# EAGLE design source_selector_v2 (EAGLE 7.5.0)
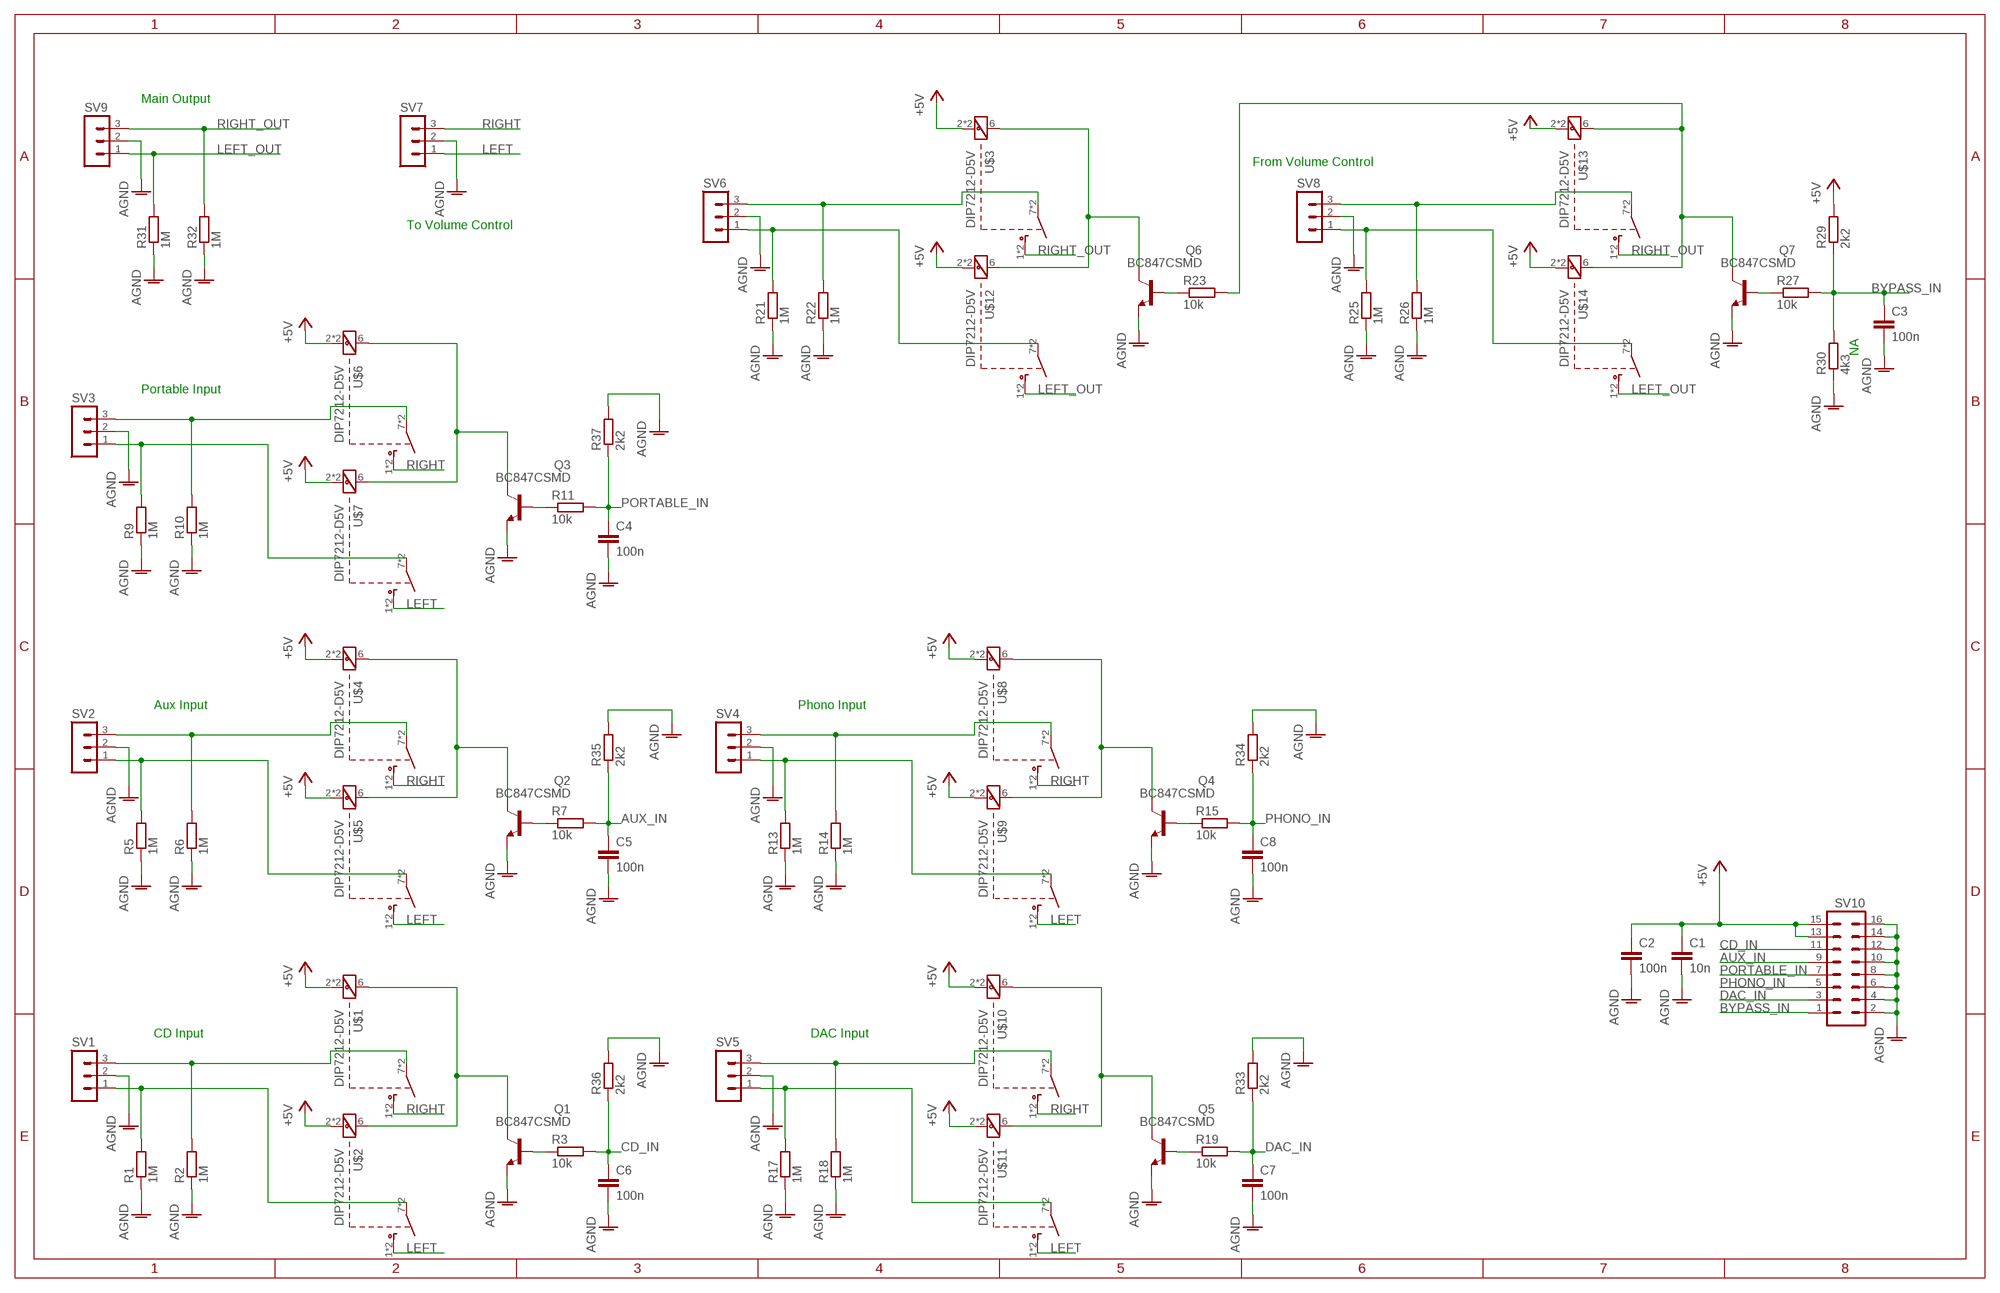
[diagram p0: schematic, sheet 1]

## Parts
C1  10n  C-EUC0603  [C0603]
C2  100n  C-EUC0603  [C0603]
C3  100n  C-EUC0603  [C0603]
C4  100n  C-EUC0603  [C0603]
C5  100n  C-EUC0603  [C0603]
C6  100n  C-EUC0603  [C0603]
C7  100n  C-EUC0603  [C0603]
C8  100n  C-EUC0603  [C0603]
Q1  BC847CSMD  [SOT23]
Q2  BC847CSMD  [SOT23]
Q3  BC847CSMD  [SOT23]
Q4  BC847CSMD  [SOT23]
Q5  BC847CSMD  [SOT23]
Q6  BC847CSMD  [SOT23]
Q7  BC847CSMD  [SOT23]
R1  1M  R-EU_R0603  [R0603]
R2  1M  R-EU_R0603  [R0603]
R3  10k  R-EU_R0603  [R0603]
R5  1M  R-EU_R0603  [R0603]
R6  1M  R-EU_R0603  [R0603]
R7  10k  R-EU_R0603  [R0603]
R9  1M  R-EU_R0603  [R0603]
R10  1M  R-EU_R0603  [R0603]
R11  10k  R-EU_R0603  [R0603]
R13  1M  R-EU_R0603  [R0603]
R14  1M  R-EU_R0603  [R0603]
R15  10k  R-EU_R0603  [R0603]
R17  1M  R-EU_R0603  [R0603]
R18  1M  R-EU_R0603  [R0603]
R19  10k  R-EU_R0603  [R0603]
R21  1M  R-EU_R0603  [R0603]
R22  1M  R-EU_R0603  [R0603]
R23  10k  R-EU_R0603  [R0603]
R25  1M  R-EU_R0603  [R0603]
R26  1M  R-EU_R0603  [R0603]
R27  10k  R-EU_R0603  [R0603]
R29  2k2  R-EU_R0603  [R0603]
R30  4k3  R-EU_R0603  [R0603]
R31  1M  R-EU_R0603  [R0603]
R32  1M  R-EU_R0603  [R0603]
R33  2k2  R-EU_R0603  [R0603]
R34  2k2  R-EU_R0603  [R0603]
R35  2k2  R-EU_R0603  [R0603]
R36  2k2  R-EU_R0603  [R0603]
R37  2k2  R-EU_R0603  [R0603]
SV1  MA03-1  [MA03-1]
SV2  MA03-1  [MA03-1]
SV3  MA03-1  [MA03-1]
SV4  MA03-1  [MA03-1]
SV5  MA03-1  [MA03-1]
SV6  MA03-1  [MA03-1]
SV7  MA03-1  [MA03-1]
SV8  MA03-1  [MA03-1]
SV9  MA03-1  [MA03-1]
SV10  MA08-2  [MA08-2]
U$1  DIP7212-D5V  [DP-07]
U$2  DIP7212-D5V  [DP-07]
U$3  DIP7212-D5V  [DP-07]
U$4  DIP7212-D5V  [DP-07]
U$5  DIP7212-D5V  [DP-07]
U$6  DIP7212-D5V  [DP-07]
U$7  DIP7212-D5V  [DP-07]
U$8  DIP7212-D5V  [DP-07]
U$9  DIP7212-D5V  [DP-07]
U$10  DIP7212-D5V  [DP-07]
U$11  DIP7212-D5V  [DP-07]
U$12  DIP7212-D5V  [DP-07]
U$13  DIP7212-D5V  [DP-07]
U$14  DIP7212-D5V  [DP-07]

## Nets
+5V: C1.1 C2.1 R29.2 SV10.13 SV10.15 U$1.2 U$1.13 U$2.2 U$2.13 U$3.2 U$3.13 U$4.2 U$4.13 U$5.2 U$5.13 U$6.2 U$6.13 U$7.2 U$7.13 U$8.2 U$8.13 U$9.2 U$9.13 U$10.2 U$10.13 U$11.2 U$11.13 U$12.2 U$12.13 U$13.2 U$13.13 U$14.2 U$14.13
AGND: C1.2 C2.2 C3.2 C4.2 C5.2 C6.2 C7.2 C8.2 Q1.2(E) Q2.2(E) Q3.2(E) Q4.2(E) Q5.2(E) Q6.2(E) Q7.2(E) R1.1 R2.1 R5.1 R6.1 R9.1 R10.1 R13.1 R14.1 R17.1 R18.1 R21.1 R22.1 R25.1 R26.1 R30.1 R31.1 R32.1 R33.2 R34.2 R35.2 R36.2 R37.2 SV1.2 SV2.2 SV3.2 SV4.2 SV5.2 SV6.2 SV7.2 SV8.2 SV9.2 SV10.2 SV10.4 SV10.6 SV10.8 SV10.10 SV10.12 SV10.14 SV10.16
AUX_IN: C5.1 R7.2 R35.1 SV10.9
BYPASS_IN: C3.1 R27.2 R29.1 R30.2 SV10.1
CD_IN: C6.1 R3.2 R36.1 SV10.11
DAC_IN: C7.1 R19.2 R33.1 SV10.3
LEFT: SV7.1 U$2.1 U$2.14 U$5.1 U$5.14 U$7.1 U$7.14 U$9.1 U$9.14 U$11.1 U$11.14
LEFT_OUT: R31.2 SV9.1 U$12.1 U$12.14 U$14.1 U$14.14
N$1: R2.2 SV1.3 U$1.7 U$1.8
N$2: R1.2 SV1.1 U$2.7 U$2.8
N$3: Q1.1(B) R3.1
N$4: Q1.3(C) U$1.6 U$2.6
N$5: R6.2 SV2.3 U$4.7 U$4.8
N$6: R5.2 SV2.1 U$5.7 U$5.8
N$7: Q2.1(B) R7.1
N$8: Q2.3(C) U$4.6 U$5.6
N$9: R10.2 SV3.3 U$6.7 U$6.8
N$10: R9.2 SV3.1 U$7.7 U$7.8
N$11: Q3.1(B) R11.1
N$12: Q3.3(C) U$6.6 U$7.6
N$13: R14.2 SV4.3 U$8.7 U$8.8
N$14: R13.2 SV4.1 U$9.7 U$9.8
N$15: Q4.1(B) R15.1
N$16: Q4.3(C) U$8.6 U$9.6
N$17: R18.2 SV5.3 U$10.7 U$10.8
N$18: R17.2 SV5.1 U$11.7 U$11.8
N$19: Q5.1(B) R19.1
N$20: Q5.3(C) U$10.6 U$11.6
N$21: R22.2 SV6.3 U$3.7 U$3.8
N$22: R21.2 SV6.1 U$12.7 U$12.8
N$23: Q6.1(B) R23.1
N$24: Q6.3(C) U$3.6 U$12.6
N$25: R26.2 SV8.3 U$13.7 U$13.8
N$26: R25.2 SV8.1 U$14.7 U$14.8
N$27: Q7.1(B) R27.1
N$29: Q7.3(C) R23.2 U$13.6 U$14.6
PHONO_IN: C8.1 R15.2 R34.1 SV10.5
PORTABLE_IN: C4.1 R11.2 R37.1 SV10.7
RIGHT: SV7.3 U$1.1 U$1.14 U$4.1 U$4.14 U$6.1 U$6.14 U$8.1 U$8.14 U$10.1 U$10.14
RIGHT_OUT: R32.2 SV9.3 U$3.1 U$3.14 U$13.1 U$13.14

## Notes on the sheet
- Main Output
- From Volume Control
- To Volume Control
- NA
- Portable Input
- Aux Input | Phono Input
- CD Input | DAC Input

## Library data of the parts
C1-C8 = rcl:C-EU: CAPACITOR, European symbol
Q1-Q7 = transistor-npn:BC847*: NPN Transistor
R1-R3 R5-R7 R9-R11 R13-R15 R17-R19 R21-R23 R25-R27 R29-R37 = rcl:R-EU_: RESISTOR, European symbol
SV1-SV9 = con-lstb:MA03-1: PIN HEADER; OC_FARNELL: unknown; OC_NEWARK: unknown
SV10 = con-lstb:MA08-2: PIN HEADER; OC_FARNELL: unknown; OC_NEWARK: unknown
U$1-U$14 = meder:DIP7212-D5V: Meder DIP 7212-D 5V Reedrelais, 5V, 1 Schließer mit Diode, 1A http://cdn-reichelt.de/documents/datenblatt/C300/DATASHEET_DIP_NEW.pdf

## Board
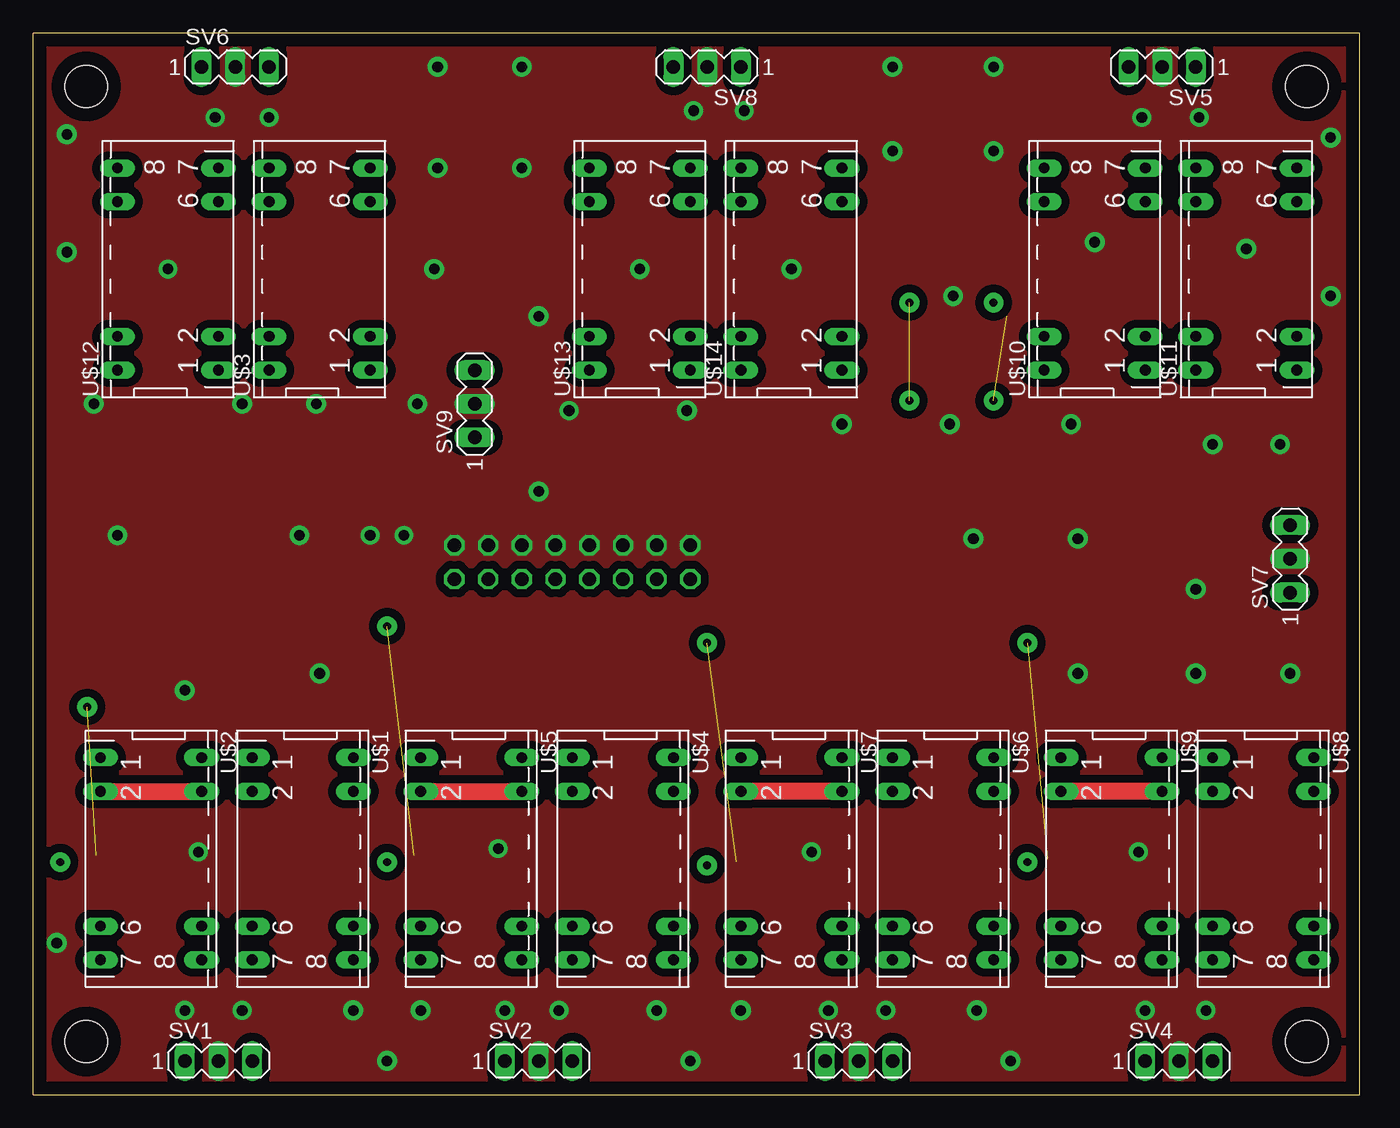
[diagram p1: board, top side]
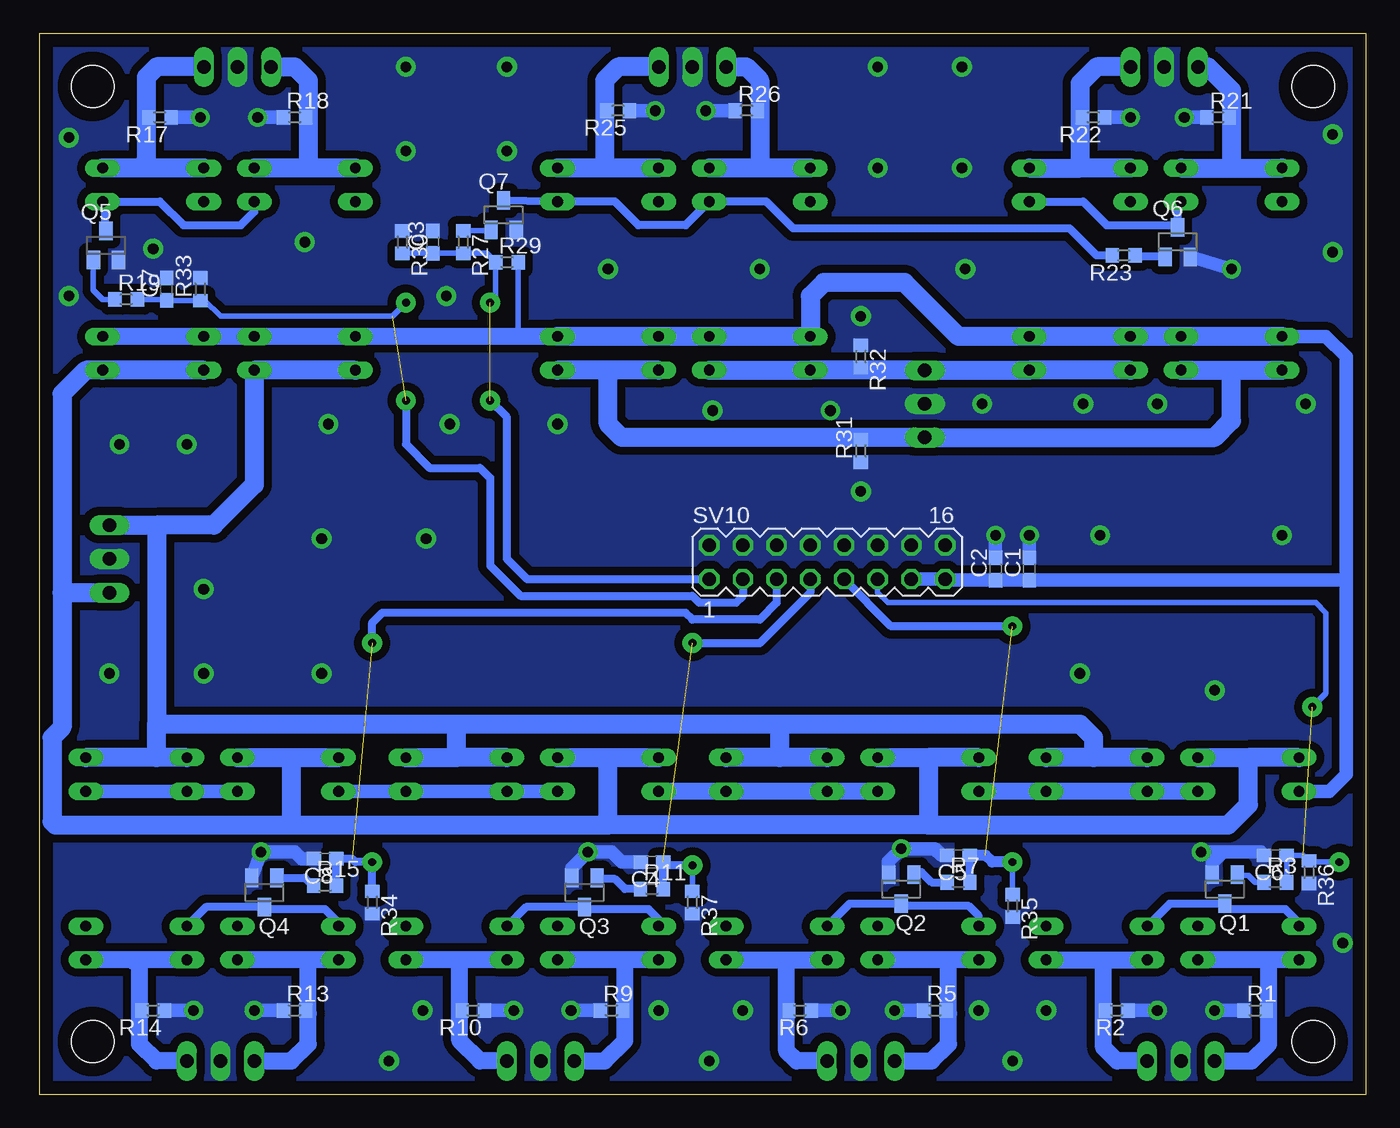
[diagram p2: board, bottom side, seen from below]

Size 100 x 80.01 mm. Coordinates in mm from the lower left corner, seen from the top.
Outline: 0,80 100,80 100,0 0,0 0,80.01
Copper layers (1*16): Top 0.035mm / dielectric 1.5mm / Bottom 0.035mm
Design rules "default *": minimum track width 10mil, minimum drill 0.6mm, track to track 8mil, track to pad 8mil, pad to pad 8mil, via to via 8mil, smd to smd 8mil, copper to edge 40mil, drill to drill 8mil, minimum pad ring 10mil, minimum via ring 8mil, stop-mask expansion 4mil, vias tented up to drill 0mil, thermal gap 10mil
Holes 3.2 mm at 4,4 96,4 96,76 4,76

### Footprints (pad centres in the part's own frame; a part is rotated, then mirrored left to right if it is on the bottom)
C0603 = smd 1.1 x 1: 1 -0.85,0; 2 0.85,0
SOT23 = smd 1 x 1.4: 1 -0.95,-1.1; 2 0.95,-1.1; 3 0,1.1
R0603 = smd 1 x 1.1: 1 -0.85,0; 2 0.85,0
MA03-1 = drill 1.016 long: 1 -2.54,0; 2 0,0; 3 2.54,0
MA08-2 = drill 1.016 octagon: 1 -8.89,-1.27; 2 -8.89,1.27; 3 -6.35,-1.27; 4 -6.35,1.27; 5 -3.81,-1.27; 6 -3.81,1.27; 7 -1.27,-1.27; 8 -1.27,1.27; 9 1.27,-1.27; 10 1.27,1.27; 11 3.81,-1.27; 12 3.81,1.27; 13 6.35,-1.27; 14 6.35,1.27; 15 8.89,-1.27; 16 8.89,1.27
DP-07 = drill 0.813 long: 1 -7.62,-3.81; 2 -5.08,-3.81; 6 5.08,-3.81; 7 7.62,-3.81; 8 7.62,3.81; 9 5.08,3.81; 13 -5.08,3.81; 14 -7.62,3.81

### Placement (x,y rotation side)
C1  25.4,39.62 90 bottom
C2  27.94,39.62 90 bottom
C3  70.36,64.26 90 bottom
C4  53.85,17.53 180 bottom
C5  30.73,18.03 180 bottom
C6  6.86,18.03 180 bottom
C7  90.42,60.71 90 bottom
C8  78.49,17.78 180 bottom
Q1  10.67,15.49 180 bottom
Q2  35.05,15.49 180 bottom
Q3  58.93,15.24 180 bottom
Q4  83.06,15.24 180 bottom
Q5  95,64.01 0 bottom
Q6  14.22,64.26 0 bottom
Q7  65.02,66.29 0 bottom
R1  8.38,6.35 0 bottom
R2  18.8,6.35 180 bottom
R3  6.86,16 0 bottom
R5  32.51,6.35 0 bottom
R6  42.67,6.35 180 bottom
R7  30.73,16 0 bottom
R9  56.9,6.35 0 bottom
R10  67.31,6.35 180 bottom
R11  53.85,15.49 0 bottom
R13  80.77,6.35 0 bottom
R14  91.44,6.35 180 bottom
R15  78.49,15.75 0 bottom
R17  90.93,73.66 180 bottom
R18  80.77,73.66 0 bottom
R19  93.47,59.94 0 bottom
R21  11.18,73.66 0 bottom
R22  20.57,73.66 180 bottom
R23  18.29,63.25 180 bottom
R25  56.39,74.17 180 bottom
R26  46.74,74.17 0 bottom
R27  68.07,64.26 270 bottom
R29  64.77,62.74 0 bottom
R30  72.64,64.26 270 bottom
R31  38.1,48.51 90 bottom
R32  38.1,55.63 270 bottom
R33  87.88,60.71 90 bottom
R34  74.93,14.48 270 bottom
R35  26.67,14.22 270 bottom
R36  4.32,16.76 270 bottom
R37  50.8,14.48 270 bottom
SV1  13.97,2.54 0 top
SV2  38.1,2.54 0 top
SV3  62.23,2.54 0 top
SV4  86.36,2.54 0 top
SV5  85.09,77.47 180 top
SV6  15.24,77.47 0 top
SV7  94.74,40.39 90 top
SV8  50.8,77.47 180 top
SV9  33.27,52.07 90 top
SV10  40.64,40.13 0 bottom
U$1  20.32,17.78 270 top
U$2  8.89,17.78 270 top
U$3  21.59,62.23 90 top
U$4  44.45,17.78 270 top
U$5  33.02,17.78 270 top
U$6  68.58,17.78 270 top
U$7  57.15,17.78 270 top
U$8  92.71,17.78 270 top
U$9  81.28,17.78 270 top
U$10  80.01,62.23 90 top
U$11  91.44,62.23 90 top
U$12  10.16,62.23 90 top
U$13  45.72,62.23 90 top
U$14  57.15,62.23 90 top

### Tracks (layer width: path | path; a pad name or v marks a point on that pad's centre or on a via)
+5V
  Top 1.27: U$7.13 U$7.2 | U$5.2 U$5.13 | U$2.2 U$2.13 | U$9.13 U$9.2
  Bottom 0.406: 74.93,23.11 75.18,22.86 | R29.2 63.92,57.49 64.26,57.15
  Bottom 1.016: C2.1 C1.1 | C2.1 1.69,38.77 1.52,38.61 | U$12.13 3.05,57.15 1.52,55.63 1.52,38.61 | C2.1 31.66,38.77 SV10.15 SV10.13 | U$10.13 73.91,57.15 | U$7.13 U$6.2 U$6.13 75.18,22.86 U$9.2 | U$9.13 U$8.2 U$8.13 | U$2.2 2.79,22.86 1.52,24.13 1.52,38.61
  Bottom 1.27: U$11.2 U$11.13 U$10.2 U$10.13 64.26,57.15 U$14.2 | U$5.2 U$1.13 U$1.2 U$2.13 | U$5.13 U$4.2 U$4.13 U$7.2
  Bottom 1.422: U$12.13 U$12.2 U$3.13 U$3.2 30.73,57.15 34.8,61.21 40.89,61.21 41.91,60.2 U$13.13 U$13.2 U$14.13 U$14.2
AGND  (via drill 0.8 pad 1.42, 0.8 pad 1.5)
  Bottom 1.016: R21.1 v13.72,73.66 | R22.1 v17.78,73.66 | R26.1 v49.78,74.17 | R25.1 v53.59,74.17 | R18.1 v83.57,73.66 | R17.1 v87.88,73.66 | R1.1 v11.43,6.35 | R2.1 v15.75,6.35 | R5.1 v35.56,6.35 | R6.1 v39.62,6.35 | R9.1 v59.94,6.35 | v64.26,6.35 R10.1 | R13.1 v83.82,6.35 | v88.39,6.35 R14.1 | Q4.2 v83.31,18.29 80.77,18.29 80.26,17.78 C8.2 | Q6.2 v10.16,62.23 | C5.2 32,18.03 32.51,18.54 v35.05,18.54 36,17.59 Q2.2 | Q1.2 11.62,17.46 10.92,18.16 v12.45,18.29 7.96,18.29 C6.2 | Q3.2 59.88,17.08 v58.67,18.29 56.9,18.29 56.13,17.53 C4.2 | C2.2 v27.94,42.16 | C1.2 v25.4,42.16
  other vias: 40.39,51.56 2.54,72.39 2.54,63.5 30.48,77.47 36.83,77.47 36.83,69.85 30.48,69.85 64.77,77.47 72.39,77.47 72.39,71.12 64.77,71.12 69.09,50.55 60.96,50.55 49.28,51.56 28.96,52.07 4.57,52.07 20.07,42.16 6.35,42.16 21.59,31.75 11.43,30.48 70.87,41.91 78.23,50.55 88.9,49.02 93.98,49.02 87.63,38.1 87.63,31.75 78.74,31.75 78.74,41.91 73.66,2.54 71.12,6.35 53.34,6.35 49.53,2.54 46.99,6.35 29.21,6.35 26.67,2.54 24.13,6.35 21.34,52.07 38.1,45.47 38.1,58.67 30.23,62.23 15.75,52.07 45.72,62.23 57.15,62.23 1.78,11.43 80.01,64.26 91.44,63.75 69.34,60.2 94.74,31.75 97.79,60.2 97.79,72.14
  pour Top (isolate 0.61, no thermals): 0.51,79.5 99.57,79.5 99.57,0.51 0.51,0.51
  pour Bottom (isolate 0.61, no thermals): 0,80.01 100.33,80.01 100.33,0 0,0
AUX_IN  (via drill 0.6 pad 1.5)  (1 unrouted)
  Bottom 0.406: R35.1 v26.67,17.53
  Bottom 0.61: R7.2 C5.1 | v26.67,35.31 35.81,35.31 SV10.9
  Bottom 0.813: v26.67,17.53 28.19,17.53 28.7,18.03 C5.1
BYPASS_IN  (via drill 0.6 pad 1.5)  (1 unrouted)
  Bottom 0.406: R30.2 C3.1 R27.2 66.29,63.41 R29.1 65.62,60.11 v66.04,59.69
  Bottom 0.61: SV10.1 63.25,38.86 64.77,40.39 64.77,51.05 v66.04,52.32
CD_IN  (via drill 0.6 pad 1.5)  (1 unrouted)
  Bottom 0.406: R3.2 C6.1 4.74,18.03 R36.1 4.23,17.53 v2.03,17.53 | SV10.11 36.83,37.85 36.07,37.08 3.81,37.08 3.05,36.32 3.05,30.23 v4.06,29.21
DAC_IN  (via drill 0.6 pad 1.5)  (1 unrouted)
  Bottom 0.406: 72.56,59.86 v72.39,59.69 73.41,58.67 86.36,58.67 87.54,59.86 R33.1 C7.1 90.51,59.94 R19.2
  Bottom 0.61: SV10.3 46.99,37.59 47.5,37.08 50.29,37.08 50.8,37.59 63.75,37.59 66.04,39.88 66.04,46.48 66.8,47.24 70.61,47.24 72.39,49.02 v72.39,52.32
LEFT
  Bottom 1.422: 98.3,37.85 SV7.1 | U$9.14 81.03,25.4 | 81.03,25.4 U$9.1 | 81.03,25.4 81.03,20.32 | 81.03,20.32 57.15,20.32 | U$7.14 57.15,25.4 | 57.15,25.4 U$7.1 | 57.15,20.32 57.15,25.4 | U$5.1 33.02,25.4 | U$2.1 8.89,25.4 | U$2.14 8.89,25.4 | 33.02,20.32 57.15,20.32 | U$5.14 33.02,25.4 | 33.02,25.4 33.02,20.32 | U$11.14 U$11.1 96.52,54.61 98.3,52.83 98.3,37.85 | 98.3,37.85 98.3,27.69 99.06,26.92 99.06,20.57 98.81,20.32 81.03,20.32 | 33.02,20.32 10.41,20.32 8.89,21.84 8.89,25.4
LEFT_OUT
  Bottom 0.254: R31.2 35.47,49.36 35.31,49.53
  Bottom 1.422: U$12.1 10.41,54.61 | 10.41,54.61 U$12.14 | U$14.14 57.4,54.61 | 57.4,54.61 U$14.1 | 57.4,54.61 57.15,54.36 57.15,50.55 56.13,49.53 35.31,49.53 SV9.1 11.43,49.53 10.16,50.8 10.16,54.36 10.41,54.61
N$1
  Bottom 0.61: R2.2 19.65,6.26 19.81,6.1
  Bottom 1.27: U$1.8 19.81,10.16 | 19.81,10.16 U$1.7 | SV1.3 18.8,2.54 19.81,3.56 19.81,6.1 19.81,10.16
N$2
  Bottom 0.61: R1.2 7.37,6.35
  Bottom 1.27: U$2.7 7.37,10.16 | 7.37,10.16 U$2.8 | SV1.1 8.64,2.54 7.37,3.81 7.37,6.35 7.37,10.16
N$3
  Bottom 0.406: 9.55,16.76 Q1.1 9.63,16.51 8.89,16.51 8.38,16 R3.1
N$4
  Bottom 0.61: U$2.6 5.08,12.95 6.1,13.97 10.24,13.97 Q1.3 | 10.33,14.06 Q1.3 | Q1.3 14.82,14.39 U$1.6
N$5
  Bottom 0.61: R6.2 43.69,6.35
  Bottom 1.27: U$4.8 43.43,10.16 | 43.43,10.16 U$4.7 | SV2.3 42.93,2.54 43.69,3.3 43.69,6.35 43.69,9.91 43.43,10.16
N$6
  Bottom 0.61: R5.2 31.66,6.26 31.5,6.1
  Bottom 1.27: U$5.7 31.5,10.16 | 31.5,10.16 U$5.8 | SV2.1 32.77,2.54 31.5,3.81 31.5,6.1 31.5,10.16
N$7
  Bottom 0.61: Q2.1 33.93,16.76 33.53,16.76 32.77,16 R7.1
N$8
  Bottom 0.61: U$5.6 29.21,13.46 29.97,14.22 34.88,14.22 Q2.3 | 34.97,14.31 Q2.3 | Q2.3 38.95,14.39 U$4.6
N$9
  Bottom 0.61: R10.2 68.16,6.26 68.33,6.1
  Bottom 1.27: U$6.7 68.07,10.16 | 68.07,10.16 U$6.8 | SV3.3 66.8,2.54 68.33,4.06 68.33,6.1 68.33,9.91 68.07,10.16
N$10
  Bottom 0.61: R9.2 56.05,6.26 55.88,6.1
  Bottom 1.27: U$7.7 55.88,10.16 | 55.88,10.16 U$7.8 | SV3.1 57.4,2.54 55.88,4.06 55.88,6.1 55.88,10.16
N$11
  Bottom 0.61: R11.1 55.88,15.49 56.64,16.26 57.89,16.26 Q3.1
N$12
  Bottom 0.61: U$7.6 53.34,13.21 54.1,13.97 58.76,13.97 Q3.3 | 58.85,14.06 Q3.3 | Q3.3 63.33,14.14 U$6.6
N$13
  Bottom 0.61: R14.2 92.46,6.35
  Bottom 1.27: U$8.7 92.96,10.16 | 92.96,10.16 U$8.8 | SV4.3 91.19,2.54 92.46,3.81 92.46,6.35 92.46,9.65 92.96,10.16
N$14
  Bottom 0.61: R13.2 79.92,6.26 79.76,6.1
  Bottom 1.27: U$9.7 79.76,10.16 | 79.76,10.16 U$9.8 | SV4.1 81.03,2.54 79.76,3.81 79.76,6.1 79.76,10.16
N$15
  Bottom 0.61: Q4.1 80.01,16.34 R15.1
N$16
  Bottom 0.61: U$9.6 77.47,12.95 78.49,13.97 82.89,13.97 Q4.3 | 82.98,14.06 Q4.3 | Q4.3 87.46,14.14 U$8.6
N$17
  Bottom 0.61: R18.2 79.92,73.32 79.76,73.15
  Bottom 1.422: U$10.8 79.25,69.85 | 79.25,69.85 U$10.7 | SV5.3 80.77,77.47 79.76,76.45 79.76,73.15 79.76,70.36 79.25,69.85
N$18
  Bottom 0.61: R17.2 91.95,73.66
  Bottom 1.422: U$11.8 92.46,69.85 | 92.46,69.85 U$11.7 | SV5.1 91.19,77.47 91.95,76.71 91.95,73.66 91.95,70.36 92.46,69.85
N$19
  Bottom 0.406: Q5.1 95.95,60.64 95.25,59.94 R19.1
N$20
  Bottom 0.61: Q5.3 95.08,67.14 U$11.6 90.93,67.31 89.15,65.53 84.84,65.53 83.82,66.55 U$10.6
N$21
  Bottom 0.61: R22.2 21.42,73.75 21.59,73.91
  Bottom 1.422: SV6.3 20.32,77.47 21.59,76.2 21.59,73.91 21.59,69.85 | U$3.8 21.59,69.85 | U$3.7 21.59,69.85
N$22
  Bottom 0.61: R21.2 10.16,73.66
  Bottom 1.422: U$12.7 9.91,69.85 | 9.91,69.85 U$12.8 | SV6.1 11.94,77.47 10.16,75.69 10.16,73.66 10.16,70.1 9.91,69.85
N$23
  Bottom 0.61: Q6.1 17.35,63.16 R23.1
N$24
  Bottom 0.61: Q6.3 | Q6.3 14.22,67.06 U$12.6 | U$3.6 21.34,67.31 19.56,65.53 14.39,65.53 Q6.3
N$25
  Bottom 0.61: R26.2 45.72,74.17
  Bottom 1.422: U$13.8 45.72,69.85 | 45.72,69.85 U$13.7 | SV8.3 46.74,77.47 45.72,76.45 45.72,74.17 45.72,69.85
N$26
  Bottom 0.61: R25.2 57.24,74.08 57.4,73.91
  Bottom 1.422: U$14.8 57.15,69.85 | 57.15,69.85 U$14.7 | SV8.1 56.39,77.47 57.4,76.45 57.4,73.91 57.4,70.1 57.15,69.85
N$27
  Bottom 0.406: R27.1 66.06,65.11 Q7.1
N$29
  Bottom 0.61: R23.2 20.32,63.25 20.7,63.63 21.08,64.01 22.35,65.28 43.18,65.28 45.21,67.31 U$13.6 51.31,65.53 54.86,65.53 56.64,67.31 U$14.6 61.47,67.31 Q7.3
PHONO_IN  (via drill 0.6 pad 1.5)  (1 unrouted)
  Bottom 0.61: R15.2 C8.1 76.45,17.78 76.2,17.53 v74.93,17.53 R34.1 | SV10.5 44.45,37.08 45.72,35.81 50.8,35.81 51.31,36.32 74.17,36.32 74.93,35.56 v74.93,34.04
PORTABLE_IN  (via drill 0.6 pad 1.5)  (1 unrouted)
  Bottom 0.406: R37.1 v50.8,17.27
  Bottom 0.61: R11.2 C4.1 52.74,17.27 v50.8,17.27 | SV10.7 41.91,37.85 45.72,34.04 v50.8,34.04
RIGHT
  Bottom 1.422: 91.19,25.4 U$8.14 | SV7.3 91.19,42.93 | 91.19,42.93 91.19,27.94 | U$8.1 91.19,25.4 | 91.19,25.4 91.19,27.94 | 91.19,27.94 68.58,27.94 | 68.58,27.94 44.2,27.94 | 44.2,27.94 21.59,27.94 20.57,26.92 20.57,25.4 | U$1.1 20.57,25.4 | 20.57,25.4 U$1.14 | 44.2,25.4 U$4.14 | U$4.1 44.2,25.4 | 44.2,25.4 44.2,27.94 | U$6.1 68.58,25.4 | U$6.14 68.58,25.4 | 68.58,25.4 68.58,27.94 | U$10.14 U$10.1 83.82,45.97 86.87,42.93 91.19,42.93
RIGHT_OUT
  Bottom 0.254: U$13.14 38.27,54.61 R32.2
  Bottom 1.422: U$13.1 U$13.14 SV9.3 U$3.1 U$3.14